# Altium schematic sheet RTD.SchDoc: RTD
size 420 x 297 mm; CheckedBy: G.Kasprowicz; Author: Ł.Pajak; CompanyName: WUT ISE; DrawnBy: Ł.pajak; Organization: WUT ISE; Address1: PW ISE; Address2: Nowowiejska 15/19 00-665 Warsaw; Address3: lpajak84@gmail.com; DocumentNumber: 2; Revision: 1.0; SheetNumber: 2; SheetTotal: 8; ModifiedBy: -; CreateDate: 15,07,2024; CheckedDate: -; Title2: converter; DivGrp: WUT ISE; Designer: Ł.Pajak; ModifiedDate: -; ProjectName: Sensor Box
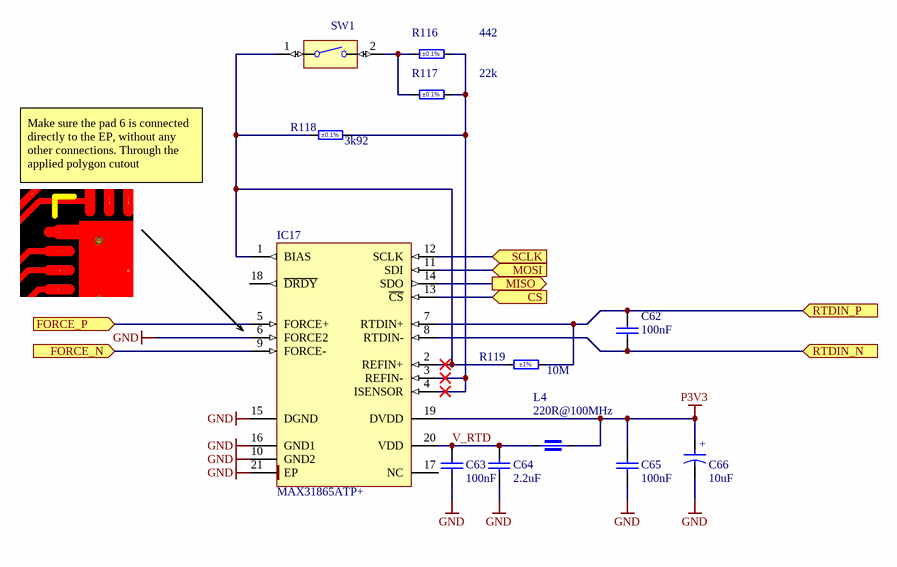
[diagram p0: RTD.SchDoc]

## Parts
C62  100nF  [CAPC1608X87N]
C63  100nF  [CAPC1608X87N]
C64  2.2uF  [CAPC1608X90N]
C65  100nF  [CAPC1608X87N]
C66  10uF  [CAPMP3216X180N]
IC17  MAX31865ATP+  [QFN65P500X500X80-21N-S335]
L4  220R@100MHz  [INDC1608X95N]
R116  442  Tolerance: ±0.1%  [RESC1608X55N]
R117  22k  Tolerance: ±0.1%  [RESC1608X64N]
R118  3k92  Tolerance: ±0.1%  [RESC1608X55N]
R119  10M  Tolerance: ±1%  [RESC1608X55N]
SW1  Switch  [SW_OMRON_A6SN-1101]  (value not drawn)

## Ports
CS (in), FORCE_N (in), FORCE_P (in), MISO (out), MOSI (in), RTDIN_N (in), RTDIN_P (in), SCLK (in)

## Nets
GND: C63.1 C64.1 C65.1 C66.2 IC17.6(FORCE2) IC17.10(GND2) IC17.15(DGND) IC17.16(GND1) IC17.21(EP)
P3V3: C65.2 C66.1 IC17.19(DVDD) L4.2
CS: IC17.13(~{CS}) ; port CS
FORCE_N: IC17.9(FORCE-) ; port FORCE_N
FORCE_P: IC17.5(FORCE+) ; port FORCE_P
MISO: IC17.14(SDO) ; port MISO
MOSI: IC17.11(SDI) ; port MOSI
RTDIN_N: C62.1 IC17.8(RTDIN-) ; port RTDIN_N
RTDIN_P: C62.2 IC17.7(RTDIN+) R119.2 ; port RTDIN_P
SCLK: IC17.12(SCLK) ; port SCLK
V_RTD: C63.2 C64.2 IC17.20(VDD) L4.1
NetIC17_1: IC17.1(BIAS) IC17.2(REFIN+) R118.1 R119.1 SW1.1
NetIC17_3: IC17.3(REFIN-) IC17.4(ISENSOR) R116.2 R117.2 R118.2
NetR116_1: R116.1 R117.1 SW1.2

Not connected (* = marked no-connect by the designer): IC17 17(NC) 18(~{DRDY})

## Notes on the sheet
- Make sure the pad 6 is connected directly to the EP, without any other connections. Through the applied polygon cutout
- Project/Equipment
- Document
- Designer
- Drawn by
- Check.by
- Copyright WUT ISE 2020.
  This documentation describes Open Hardware and is licensed under the CERN OHL v.1.2. You may redistribute and modify this documentation under the terms of the CERN OHL v.1.2. (http://ohwr.org/CERNOHL). This documentation is distributed WITHOUT ANY EXPRESS OR IMPLIED WARRANTY, INCLUDING OF MERCHANTABILITY, SATISFACTORY QUALITY AND FITNESS FOR A PARTICULAR PURPOSE. Please see the CERN OHL v.1.2 for applicable conditions.
- Contact
- File
- Last Mod.
- Print Date
- Sheet
- Size
- A3
- of
- Rev
- (in symbol CTE3216-18_10UF_16V_20%_AVX_TCJ) +

## Library data of the parts
C62 C63 C65 = CC0603_100NF_50V_10%_X7R: Non-polarised capacitor; Part Description: SMD Multilayer Chip Ceramic Capacitor; Manufacturer: GENERIC; Manufacturer1 Part Number: 223858615649; Voltage: 50V; TC: X7R; Tolerance: ±10%; Part Number: CC0603_100NF_50V_10%_X7R; Component Kind: Standard; Component Type: Standard; Pin Count: 2; Value: 100nF; Status: Preferred; Manufacturer Part Number: CC0603_100NF_50V_10%_X7R; Case: 0603; Mounted: Yes; Socket: No; SMD: Yes; Sense: No; Manufacturer1 Example: PHYCOMP; Manufacturer1 ComponentHeight: 0.87mm; HelpURL: \\cern.ch\dfs\Applications\Altium\Datasheets\CC0603_X7R_PHYCOMP.pdf; Author: CERN DEM JLC; CreateDate: 03.12.2007; LatestRevisionDate: 03.12.2007
C64 = CC0603_2.2UF_10V_20%_X7R: Non-polarised capacitor; Part Description: SMD Multilayer Chip Ceramic Capacitor; Manufacturer: GENERIC; Manufacturer1 Part Number: LMK107B7225MA-T; Voltage: 10V; TC: X7R; Tolerance: ±20%; Part Number: CC0603_2.2UF_10V_20%_X7R; Component Kind: Standard; Component Type: Standard; Pin Count: 2; Value: 2.2uF; Status: Not Recommended; Manufacturer Part Number: CC0603_2.2UF_10V_20%_X7R; Case: 0603; Mounted: Yes; Socket: No; SMD: Yes; Sense: No; Manufacturer1 Example: TAIYO YUDEN; Manufacturer1 ComponentHeight: 0.9mm; HelpURL: \\cern.ch\dfs\Applications\Altium\Datasheets\CC0603_X7R_TAIYO-YUDEN_HIGH-VALUE.pdf; Author: CERN DEM JLC; CreateDate: 22.06.2011; LatestRevisionDate: 27.06.2011
C66 = CTE3216-18_10UF_16V_20%_AVX_TCJ: Polarised capacitor; Part Description: ESR 0R200 Tantalum Solid Electrolytic Chip Capacitor with Conductive Polymer Electrode; Manufacturer: AVX; Manufacturer Part Number: TCJA106M016R0200; Voltage: 16V; Tolerance: ±20%; Part Number: CTE3216-18_10UF_16V_20%_AVX_TCJ; Component Kind: Standard; Component Type: Standard; Pin Count: 2; Value: 10uF; Status: Preferred; Case: A; Mounted: Yes; Socket: No; SMD: Yes; Sense: No; ComponentHeight: 1.8mm; HelpURL: \\cern.ch\dfs\Applications\Altium\Datasheets\CTE_AVX_TCJ.pdf; Author: CERN DEM JLC; CreateDate: 29.03.2012; LatestRevisionDate: 29.03.2012
IC17 = MAX31865ATP+: RTD-to-Digital Converter; Manufacturer: MAXIM; PressFit: No; Bonding: No; Part Number: MAX31865ATP+; Component Kind: Standard; Component Type: Standard; Device: MAX31865ATP+; PackageDescription: QFN, 0.65mm pitch, Square; 20 pin, 5.00mm L X 5.00mm W X 0.80mm H body (w/Thermal Tab 3.35 X 3.35mm), IPC Medium Density; Part Description: RTD-to-Digital Converter; Manufacturer Part Number: MAX31865ATP; Pin Count: 21; Case: QFN20; Mounted: Yes; Socket: No; SMD: Yes; Sense: No; ComponentHeight: 0.8mm; Author: CERN DEM MR; HelpURL: \\cern.ch\dfs\Applications\Altium\Datasheets\MAX31865ATP+.pdf; CreateDate: 09.06.2016; LatestRevisionDate: 04.04.2022
L4 = IND0603_MURATA_BLM18SG221TN1: Part Description: SMD EMIFIL Suppression Chip Ferrite Bead; Manufacturer: MURATA; Power: 2.5A; Resistance: 0.04R; Tolerance: ±25%; Part Number: IND0603_MURATA_BLM18SG221TN1; Component Kind: Standard; Component Type: Standard; Pin Count: 2; Value: 220R@100MHz; Manufacturer Part Number: BLM18SG221TN1; Case: 0603; Mounted: Yes; Socket: No; SMD: Yes; Sense: No; ComponentHeight: 0.95mm; HelpURL: \\cern.ch\dfs\Applications\Altium\Datasheets\IND0603_MURATA_BLM18S.pdf; Author: CERN DEM MR; CreateDate: 08.01.2016; LatestRevisionDate: 25.10.2018
R116 = R0603_442R_0.1%_0.063W_10PPM: Resistor - 0.1%; Part Description: Thin Film Chip Resistor; Manufacturer: GENERIC; Manufacturer1 Part Number: RN73C1J442RBTDF; Power: 0.063W; TC: ±10ppm; PressFit: No; Part Number: R0603_442R_0.1%_0.063W_10PPM; Component Kind: Standard; Component Type: Standard; Pin Count: 2; Value: 442; Status: Not Recommended; Manufacturer Part Number: R0603_442R_0.1%_0.063W_10PPM; Case: 0603; Mounted: Yes; Sense: No; Socket: No; SMD: Yes; Manufacturer1 Example: TYCO HOLSWORTHY; Manufacturer1 ComponentHeight: 0.5mm; HelpURL: \\cern.ch\dfs\Applications\Altium\Datasheets\R0603_Tyco_RN73.pdf; Author: CERN DEM JLC; CreateDate: 03.12.2007; LatestRevisionDate: 13.03.2008
R117 = R0603_22K_0.1%_0.1W_25PPM: Resistor - 0.1%; Part Description: Thin Film Chip Resistor; Manufacturer: GENERIC; Manufacturer1 Part Number: ERA-3AEB223V; Power: 0.1W; TC: ±25ppm/°C; PressFit: No; Part Number: R0603_22K_0.1%_0.1W_25PPM; Component Kind: Standard; Component Type: Standard; Pin Count: 2; Value: 22k; Status: Not Recommended; Manufacturer Part Number: R0603_22K_0.1%_0.1W_25PPM; Case: 0603; Mounted: Yes; Sense: No; Socket: No; SMD: Yes; Manufacturer1 Example: PANASONIC; Manufacturer1 ComponentHeight: 0.55mm; HelpURL: \\cern.ch\dfs\Applications\Altium\Datasheets\R0603_PANASONIC_ERA.pdf; Author: CERN DEM HF; CreateDate: 18.10.2023; LatestRevisionDate: 18.10.2023
R118 = R0603_3K92_0.1%_0.063W_10PPM: Resistor - 0.1%; Part Description: Thin Film Chip Resistor; Manufacturer: GENERIC; Manufacturer1 Part Number: RN73C1J3K92BTDF; Power: 0.063W; TC: ±10ppm; PressFit: No; Part Number: R0603_3K92_0.1%_0.063W_10PPM; Component Kind: Standard; Component Type: Standard; Pin Count: 2; Value: 3k92; Status: Not Recommended; Manufacturer Part Number: R0603_3K92_0.1%_0.063W_10PPM; Case: 0603; Mounted: Yes; Sense: No; Socket: No; SMD: Yes; Manufacturer1 Example: TYCO HOLSWORTHY; Manufacturer1 ComponentHeight: 0.5mm; HelpURL: \\cern.ch\dfs\Applications\Altium\Datasheets\R0603_Tyco_RN73.pdf; Author: CERN DEM JLC; CreateDate: 03.12.2007; LatestRevisionDate: 13.03.2008
R119 = R0603_10M_1%_0.1W_100PPM: Resistor - 1%; Part Description: General Purpose Thick Film Chip Resistor; Manufacturer: GENERIC; Manufacturer1 Part Number: CRCW060310M0FKEA; Power: 0.1W; TC: ±100ppm/°C; PressFit: No; Part Number: R0603_10M_1%_0.1W_100PPM; Component Kind: Standard; Component Type: Standard; Pin Count: 2; Value: 10M; Status: Preferred; Manufacturer Part Number: R0603_10M_1%_0.1W_100PPM; Case: 0603; Mounted: Yes; Sense: No; Socket: No; SMD: Yes; Manufacturer1 Example: VISHAY; Manufacturer1 ComponentHeight: 0.55mm; HelpURL: \\cern.ch\dfs\Applications\Altium\Datasheets\R0603_VISHAY_CRCW e3.pdf; Author: CERN DEM JLC; CreateDate: 12.01.2017; LatestRevisionDate: 12.01.2017
SW1 = SW_OMRON_A6SN-1101: 1 Ways SPST DIP Switch; Part Description: 1 Way SPST Surface-Mounting Slide Switch with Flat Actuator, Contact Rating 25mA 24VDC; Manufacturer: OMRON; PressFit: No; Part Number: SW_OMRON_A6SN-1101; Component Kind: Standard; Component Type: Standard; Pin Count: 2; PackageDescription: Body 4.48x7.5mm, 1 Way SPST Surface-Mounting Slide Switch With Flat Actuator (A6SN Series); Family: Switch; Mounted: Yes; Socket: No; SMD: Yes; Sense: No; Status: None; Manufacturer Part Number: A6SN-1101; ComponentHeight: 4.6mm; HelpURL: \\cern.ch\dfs\Applications\Altium\Datasheets\SW_OMRON_A6SN-1101.pdf; Author: CERN DEM JLC; CreateDate: 25.02.2013; LatestRevisionDate: 25.02.2013